# EAGLE design REV001 (EAGLE 9.7.0)
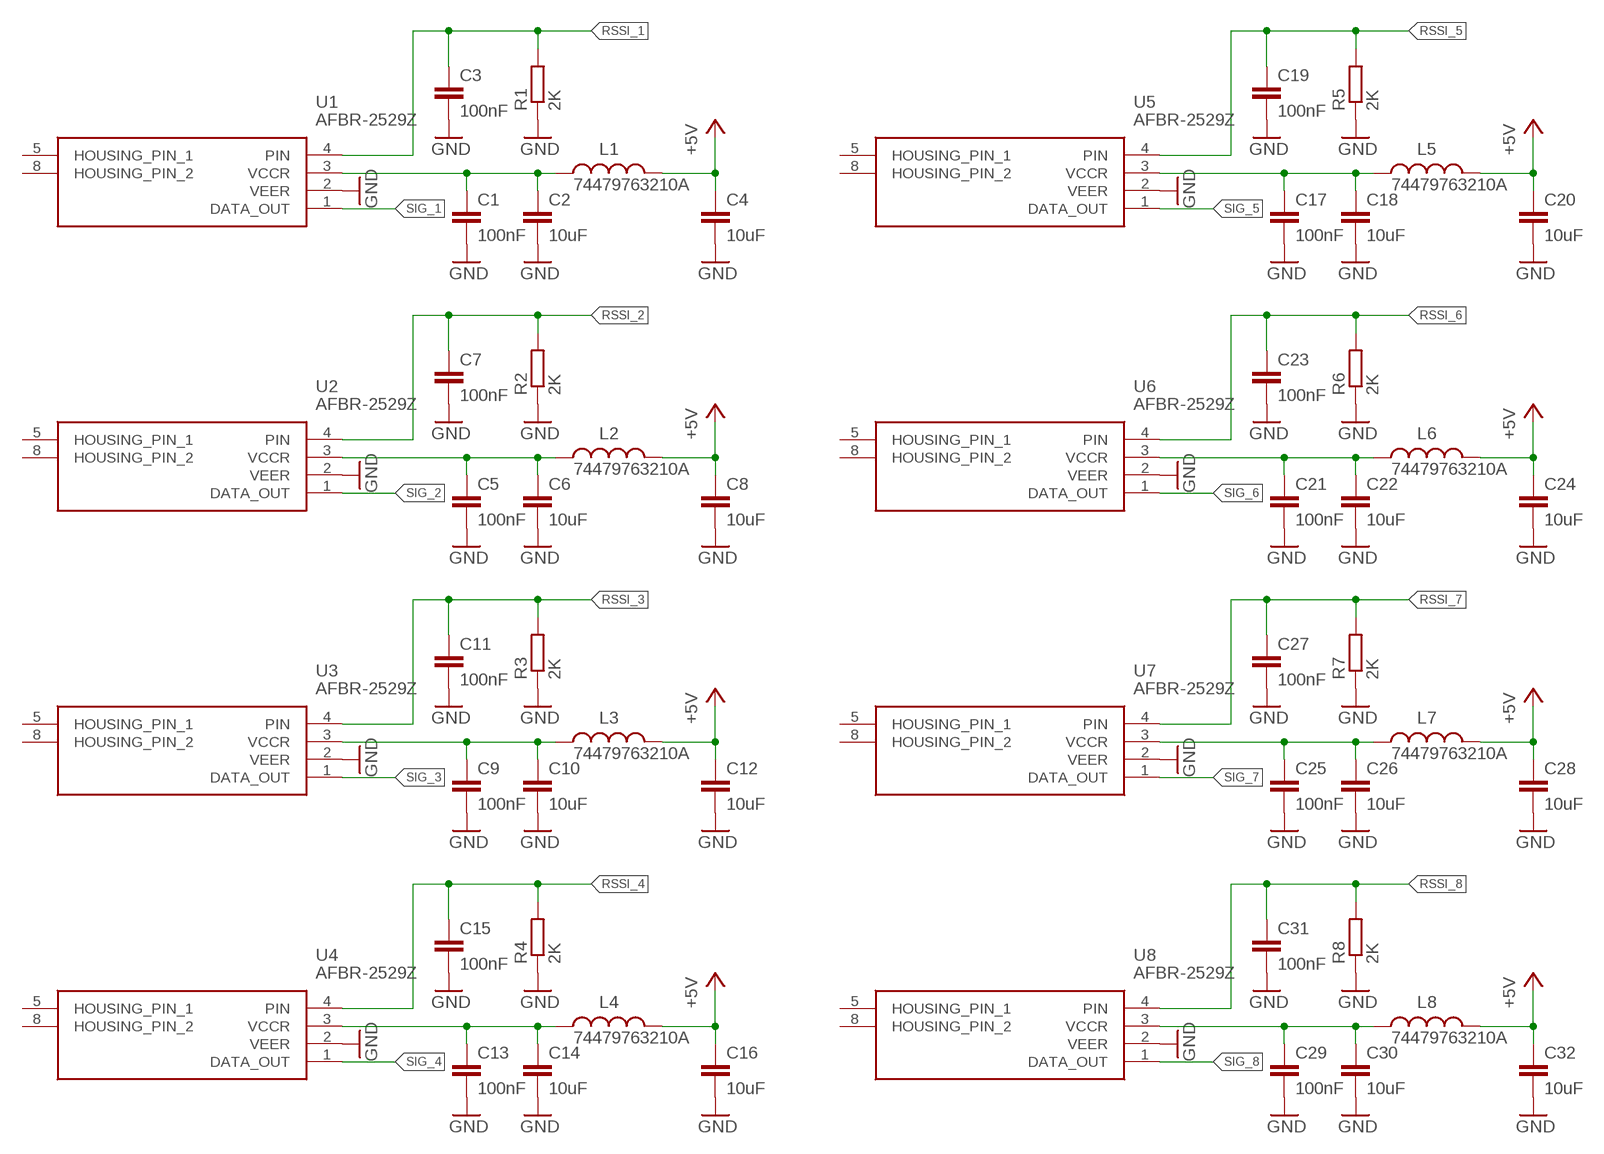
[diagram p0: schematic, sheet 1, part 1 of 2]
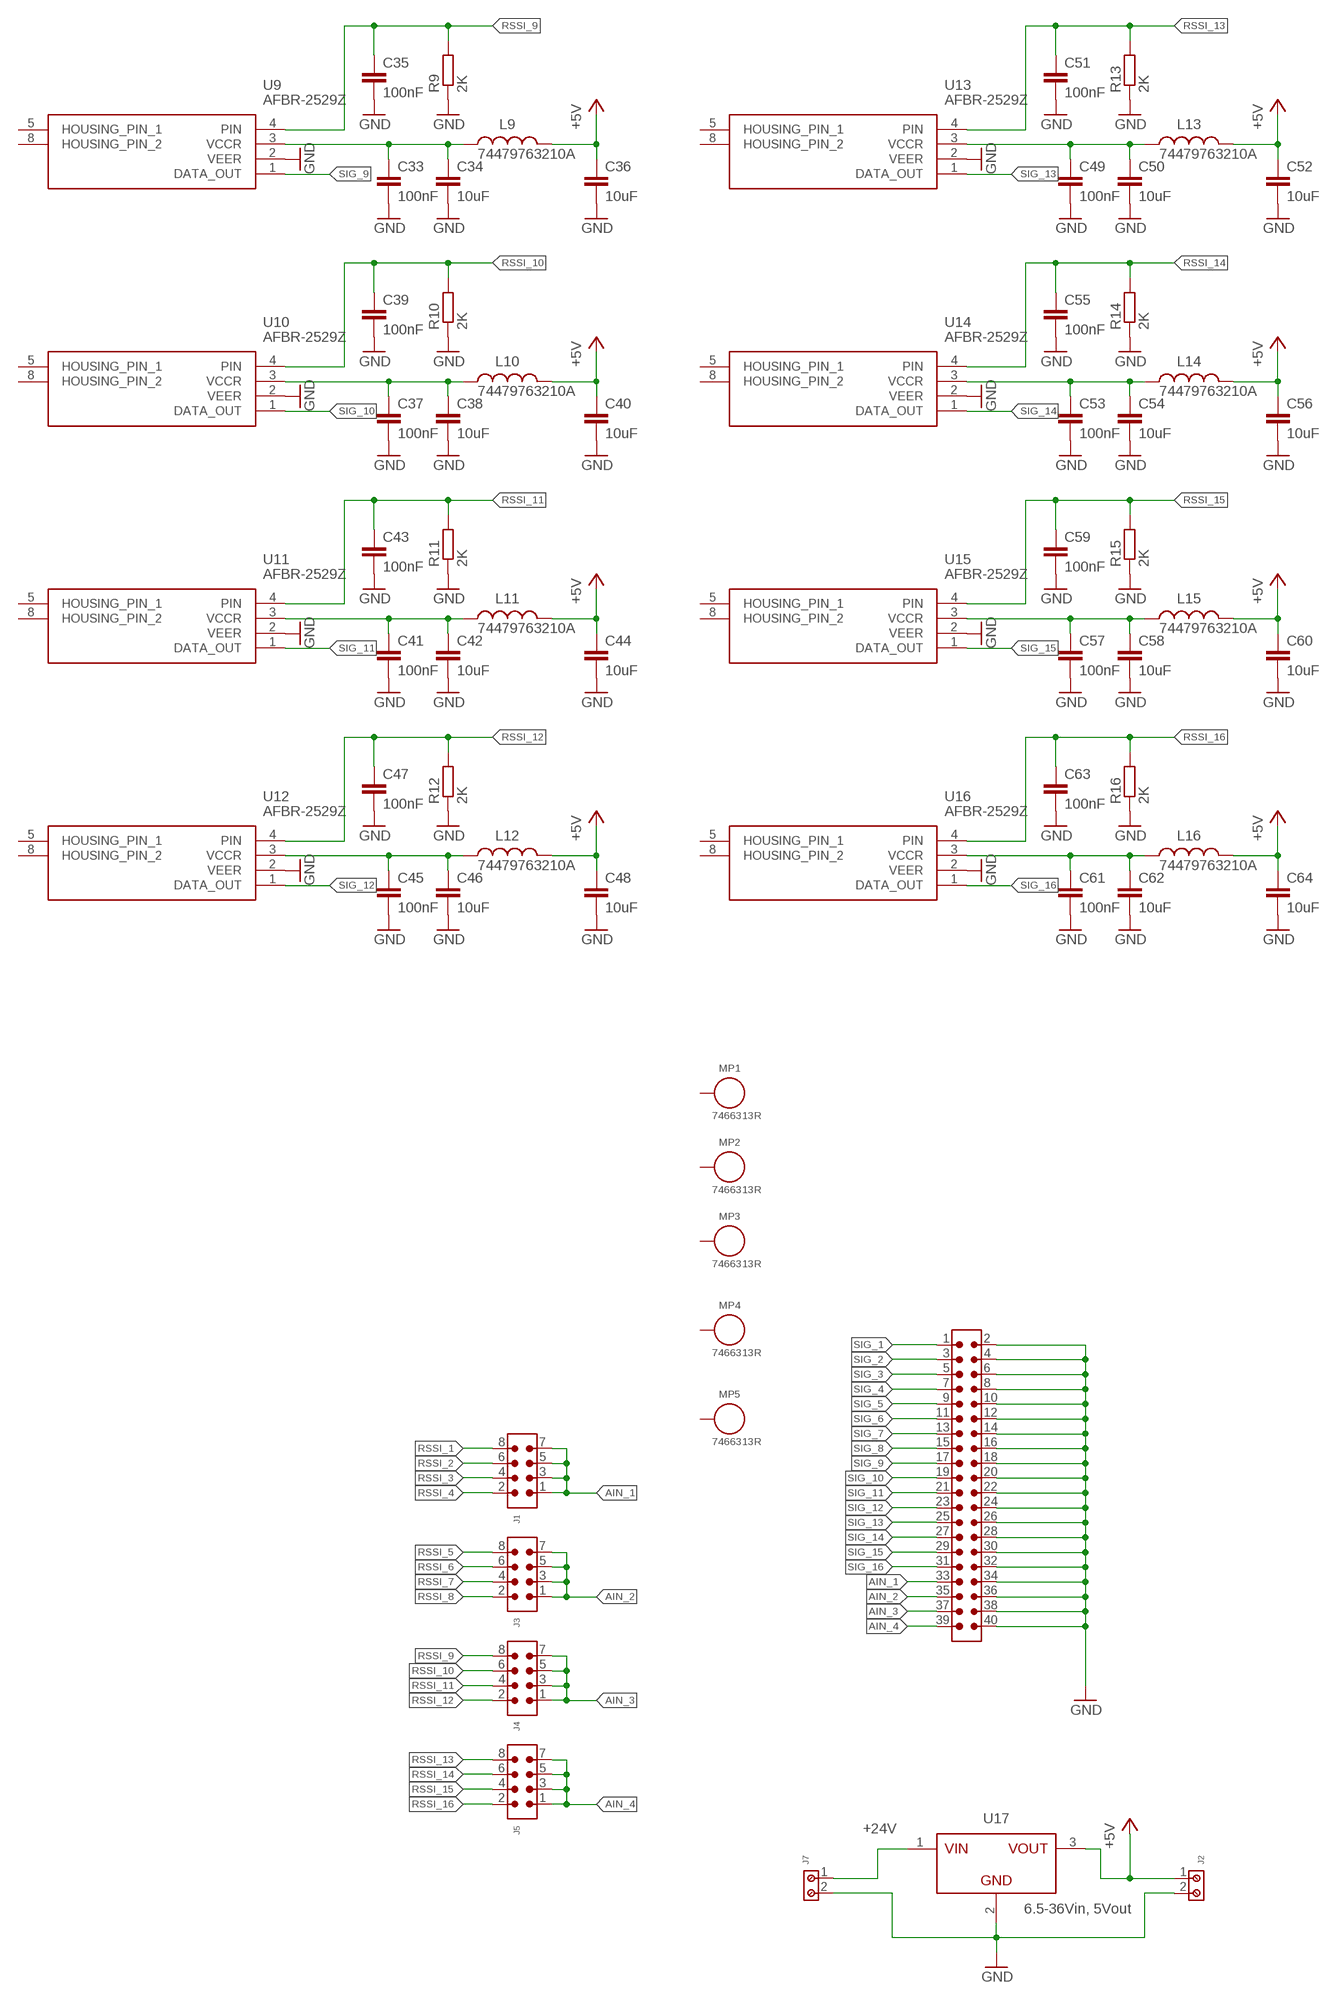
[diagram p1: schematic, sheet 1, part 2 of 2]

## Parts
C1  100nF  C-EUC0603K  [C0603K]
C2  10uF  C-EUC1210K  [C1210K]
C3  100nF  C-EUC0603K  [C0603K]
C4  10uF  C-EUC1210K  [C1210K]
C5  100nF  C-EUC0603K  [C0603K]
C6  10uF  C-EUC1210K  [C1210K]
C7  100nF  C-EUC0603K  [C0603K]
C8  10uF  C-EUC1210K  [C1210K]
C9  100nF  C-EUC0603K  [C0603K]
C10  10uF  C-EUC1210K  [C1210K]
C11  100nF  C-EUC0603K  [C0603K]
C12  10uF  C-EUC1210K  [C1210K]
C13  100nF  C-EUC0603K  [C0603K]
C14  10uF  C-EUC1210K  [C1210K]
C15  100nF  C-EUC0603K  [C0603K]
C16  10uF  C-EUC1210K  [C1210K]
C17  100nF  C-EUC0603K  [C0603K]
C18  10uF  C-EUC1210K  [C1210K]
C19  100nF  C-EUC0603K  [C0603K]
C20  10uF  C-EUC1210K  [C1210K]
C21  100nF  C-EUC0603K  [C0603K]
C22  10uF  C-EUC1210K  [C1210K]
C23  100nF  C-EUC0603K  [C0603K]
C24  10uF  C-EUC1210K  [C1210K]
C25  100nF  C-EUC0603K  [C0603K]
C26  10uF  C-EUC1210K  [C1210K]
C27  100nF  C-EUC0603K  [C0603K]
C28  10uF  C-EUC1210K  [C1210K]
C29  100nF  C-EUC0603K  [C0603K]
C30  10uF  C-EUC1210K  [C1210K]
C31  100nF  C-EUC0603K  [C0603K]
C32  10uF  C-EUC1210K  [C1210K]
C33  100nF  C-EUC0603K  [C0603K]
C34  10uF  C-EUC1210K  [C1210K]
C35  100nF  C-EUC0603K  [C0603K]
C36  10uF  C-EUC1210K  [C1210K]
C37  100nF  C-EUC0603K  [C0603K]
C38  10uF  C-EUC1210K  [C1210K]
C39  100nF  C-EUC0603K  [C0603K]
C40  10uF  C-EUC1210K  [C1210K]
C41  100nF  C-EUC0603K  [C0603K]
C42  10uF  C-EUC1210K  [C1210K]
C43  100nF  C-EUC0603K  [C0603K]
C44  10uF  C-EUC1210K  [C1210K]
C45  100nF  C-EUC0603K  [C0603K]
C46  10uF  C-EUC1210K  [C1210K]
C47  100nF  C-EUC0603K  [C0603K]
C48  10uF  C-EUC1210K  [C1210K]
C49  100nF  C-EUC0603K  [C0603K]
C50  10uF  C-EUC1210K  [C1210K]
C51  100nF  C-EUC0603K  [C0603K]
C52  10uF  C-EUC1210K  [C1210K]
C53  100nF  C-EUC0603K  [C0603K]
C54  10uF  C-EUC1210K  [C1210K]
C55  100nF  C-EUC0603K  [C0603K]
C56  10uF  C-EUC1210K  [C1210K]
C57  100nF  C-EUC0603K  [C0603K]
C58  10uF  C-EUC1210K  [C1210K]
C59  100nF  C-EUC0603K  [C0603K]
C60  10uF  C-EUC1210K  [C1210K]
C61  100nF  C-EUC0603K  [C0603K]
C62  10uF  C-EUC1210K  [C1210K]
C63  100nF  C-EUC0603K  [C0603K]
C64  10uF  C-EUC1210K  [C1210K]
J1  6130XX21121_61300821121  [61300821121]
J2  691213710002  [691213710002]
J3  6130XX21121_61300821121  [61300821121]
J4  6130XX21121_61300821121  [61300821121]
J5  6130XX21121_61300821121  [61300821121]
J6  61204021721  6120XX21721_61204021721  [61204021721]
J7  691213710002  [691213710002]
L1  74479763210A  WE-PMI_0603_74479763210A_H0.5  [WE-PMI_0603_H0.5]
L2  74479763210A  WE-PMI_0603_74479763210A_H0.5  [WE-PMI_0603_H0.5]
L3  74479763210A  WE-PMI_0603_74479763210A_H0.5  [WE-PMI_0603_H0.5]
L4  74479763210A  WE-PMI_0603_74479763210A_H0.5  [WE-PMI_0603_H0.5]
L5  74479763210A  WE-PMI_0603_74479763210A_H0.5  [WE-PMI_0603_H0.5]
L6  74479763210A  WE-PMI_0603_74479763210A_H0.5  [WE-PMI_0603_H0.5]
L7  74479763210A  WE-PMI_0603_74479763210A_H0.5  [WE-PMI_0603_H0.5]
L8  74479763210A  WE-PMI_0603_74479763210A_H0.5  [WE-PMI_0603_H0.5]
L9  74479763210A  WE-PMI_0603_74479763210A_H0.5  [WE-PMI_0603_H0.5]
L10  74479763210A  WE-PMI_0603_74479763210A_H0.5  [WE-PMI_0603_H0.5]
L11  74479763210A  WE-PMI_0603_74479763210A_H0.5  [WE-PMI_0603_H0.5]
L12  74479763210A  WE-PMI_0603_74479763210A_H0.5  [WE-PMI_0603_H0.5]
L13  74479763210A  WE-PMI_0603_74479763210A_H0.5  [WE-PMI_0603_H0.5]
L14  74479763210A  WE-PMI_0603_74479763210A_H0.5  [WE-PMI_0603_H0.5]
L15  74479763210A  WE-PMI_0603_74479763210A_H0.5  [WE-PMI_0603_H0.5]
L16  74479763210A  WE-PMI_0603_74479763210A_H0.5  [WE-PMI_0603_H0.5]
MP1  7466313R  WP-SMRA_746631X_7466313R  [WP-SMRA_7466313]
MP2  7466313R  WP-SMRA_746631X_7466313R  [WP-SMRA_7466313]
MP3  7466313R  WP-SMRA_746631X_7466313R  [WP-SMRA_7466313]
MP4  7466313R  WP-SMRA_746631X_7466313R  [WP-SMRA_7466313]
MP5  7466313R  WP-SMRA_746631X_7466313R  [WP-SMRA_7466313]
R1  2K  R-EU_R0603  [R0603]
R2  2K  R-EU_R0603  [R0603]
R3  2K  R-EU_R0603  [R0603]
R4  2K  R-EU_R0603  [R0603]
R5  2K  R-EU_R0603  [R0603]
R6  2K  R-EU_R0603  [R0603]
R7  2K  R-EU_R0603  [R0603]
R8  2K  R-EU_R0603  [R0603]
R9  2K  R-EU_R0603  [R0603]
R10  2K  R-EU_R0603  [R0603]
R11  2K  R-EU_R0603  [R0603]
R12  2K  R-EU_R0603  [R0603]
R13  2K  R-EU_R0603  [R0603]
R14  2K  R-EU_R0603  [R0603]
R15  2K  R-EU_R0603  [R0603]
R16  2K  R-EU_R0603  [R0603]
U1  AFBR-2529Z  [AFBR2624Z]
U2  AFBR-2529Z  [AFBR2624Z]
U3  AFBR-2529Z  [AFBR2624Z]
U4  AFBR-2529Z  [AFBR2624Z]
U5  AFBR-2529Z  [AFBR2624Z]
U6  AFBR-2529Z  [AFBR2624Z]
U7  AFBR-2529Z  [AFBR2624Z]
U8  AFBR-2529Z  [AFBR2624Z]
U9  AFBR-2529Z  [AFBR2624Z]
U10  AFBR-2529Z  [AFBR2624Z]
U11  AFBR-2529Z  [AFBR2624Z]
U12  AFBR-2529Z  [AFBR2624Z]
U13  AFBR-2529Z  [AFBR2624Z]
U14  AFBR-2529Z  [AFBR2624Z]
U15  AFBR-2529Z  [AFBR2624Z]
U16  AFBR-2529Z  [AFBR2624Z]
U17  6.5-36Vin, 5Vout  WPME-FDSM_SIP-3_173950536_17395XX36  [WPME-FDSM_17395XX36]

## Nets
+5V: C4.1 C8.1 C12.1 C16.1 C20.1 C24.1 C28.1 C32.1 C36.1 C40.1 C44.1 C48.1 C52.1 C56.1 C60.1 C64.1 J2.1 L1.2 L2.2 L3.2 L4.2 L5.2 L6.2 L7.2 L8.2 L9.2 L10.2 L11.2 L12.2 L13.2 L14.2 L15.2 L16.2 U17.3(VOUT)
+24V: J7.1 U17.1(VIN)
AIN_1: J1.1 J1.3 J1.5 J1.7 J6.33
AIN_2: J3.1 J3.3 J3.5 J3.7 J6.35
AIN_3: J4.1 J4.3 J4.5 J4.7 J6.37
AIN_4: J5.1 J5.3 J5.5 J5.7 J6.39
GND: C1.2 C2.2 C3.2 C4.2 C5.2 C6.2 C7.2 C8.2 C9.2 C10.2 C11.2 C12.2 C13.2 C14.2 C15.2 C16.2 C17.2 C18.2 C19.2 C20.2 C21.2 C22.2 C23.2 C24.2 C25.2 C26.2 C27.2 C28.2 C29.2 C30.2 C31.2 C32.2 C33.2 C34.2 C35.2 C36.2 C37.2 C38.2 C39.2 C40.2 C41.2 C42.2 C43.2 C44.2 C45.2 C46.2 C47.2 C48.2 C49.2 C50.2 C51.2 C52.2 C53.2 C54.2 C55.2 C56.2 C57.2 C58.2 C59.2 C60.2 C61.2 C62.2 C63.2 C64.2 J2.2 J6.2 J6.4 J6.6 J6.8 J6.10 J6.12 J6.14 J6.16 J6.18 J6.20 J6.22 J6.24 J6.26 J6.28 J6.30 J6.32 J6.34 J6.36 J6.38 J6.40 J7.2 R1.1 R2.1 R3.1 R4.1 R5.1 R6.1 R7.1 R8.1 R9.1 R10.1 R11.1 R12.1 R13.1 R14.1 R15.1 R16.1 U1.2(VEER) U2.2(VEER) U3.2(VEER) U4.2(VEER) U5.2(VEER) U6.2(VEER) U7.2(VEER) U8.2(VEER) U9.2(VEER) U10.2(VEER) U11.2(VEER) U12.2(VEER) U13.2(VEER) U14.2(VEER) U15.2(VEER) U16.2(VEER) U17.2(GND)
N$1: C1.1 C2.1 L1.1 U1.3(VCCR)
N$2: C5.1 C6.1 L2.1 U2.3(VCCR)
N$3: C9.1 C10.1 L3.1 U3.3(VCCR)
N$4: C13.1 C14.1 L4.1 U4.3(VCCR)
N$5: C17.1 C18.1 L5.1 U5.3(VCCR)
N$6: C21.1 C22.1 L6.1 U6.3(VCCR)
N$7: C25.1 C26.1 L7.1 U7.3(VCCR)
N$8: C29.1 C30.1 L8.1 U8.3(VCCR)
N$9: C33.1 C34.1 L9.1 U9.3(VCCR)
N$10: C37.1 C38.1 L10.1 U10.3(VCCR)
N$11: C41.1 C42.1 L11.1 U11.3(VCCR)
N$12: C45.1 C46.1 L12.1 U12.3(VCCR)
N$13: C49.1 C50.1 L13.1 U13.3(VCCR)
N$14: C53.1 C54.1 L14.1 U14.3(VCCR)
N$15: C57.1 C58.1 L15.1 U15.3(VCCR)
N$16: C61.1 C62.1 L16.1 U16.3(VCCR)
RSSI_1: C3.1 J1.8 R1.2 U1.4(PIN)
RSSI_2: C7.1 J1.6 R2.2 U2.4(PIN)
RSSI_3: C11.1 J1.4 R3.2 U3.4(PIN)
RSSI_4: C15.1 J1.2 R4.2 U4.4(PIN)
RSSI_5: C19.1 J3.8 R5.2 U5.4(PIN)
RSSI_6: C23.1 J3.6 R6.2 U6.4(PIN)
RSSI_7: C27.1 J3.4 R7.2 U7.4(PIN)
RSSI_8: C31.1 J3.2 R8.2 U8.4(PIN)
RSSI_9: C35.1 J4.8 R9.2 U9.4(PIN)
RSSI_10: C39.1 J4.6 R10.2 U10.4(PIN)
RSSI_11: C43.1 J4.4 R11.2 U11.4(PIN)
RSSI_12: C47.1 J4.2 R12.2 U12.4(PIN)
RSSI_13: C51.1 J5.8 R13.2 U13.4(PIN)
RSSI_14: C55.1 J5.6 R14.2 U14.4(PIN)
RSSI_15: C59.1 J5.4 R15.2 U15.4(PIN)
RSSI_16: C63.1 J5.2 R16.2 U16.4(PIN)
SIG_1: J6.1 U1.1(DATA_OUT)
SIG_2: J6.3 U2.1(DATA_OUT)
SIG_3: J6.5 U3.1(DATA_OUT)
SIG_4: J6.7 U4.1(DATA_OUT)
SIG_5: J6.9 U5.1(DATA_OUT)
SIG_6: J6.11 U6.1(DATA_OUT)
SIG_7: J6.13 U7.1(DATA_OUT)
SIG_8: J6.15 U8.1(DATA_OUT)
SIG_9: J6.17 U9.1(DATA_OUT)
SIG_10: J6.19 U10.1(DATA_OUT)
SIG_11: J6.21 U11.1(DATA_OUT)
SIG_12: J6.23 U12.1(DATA_OUT)
SIG_13: J6.25 U13.1(DATA_OUT)
SIG_14: J6.27 U14.1(DATA_OUT)
SIG_15: J6.29 U15.1(DATA_OUT)
SIG_16: J6.31 U16.1(DATA_OUT)
Unconnected: MP1.1 MP2.1 MP3.1 MP4.1 MP5.1 U1.5(HOUSING_PIN_1) U1.8(HOUSING_PIN_2) U2.5(HOUSING_PIN_1) U2.8(HOUSING_PIN_2) U3.5(HOUSING_PIN_1) U3.8(HOUSING_PIN_2) U4.5(HOUSING_PIN_1) U4.8(HOUSING_PIN_2) U5.5(HOUSING_PIN_1) U5.8(HOUSING_PIN_2) U6.5(HOUSING_PIN_1) U6.8(HOUSING_PIN_2) U7.5(HOUSING_PIN_1) U7.8(HOUSING_PIN_2) U8.5(HOUSING_PIN_1) U8.8(HOUSING_PIN_2) U9.5(HOUSING_PIN_1) U9.8(HOUSING_PIN_2) U10.5(HOUSING_PIN_1) U10.8(HOUSING_PIN_2) U11.5(HOUSING_PIN_1) U11.8(HOUSING_PIN_2) U12.5(HOUSING_PIN_1) U12.8(HOUSING_PIN_2) U13.5(HOUSING_PIN_1) U13.8(HOUSING_PIN_2) U14.5(HOUSING_PIN_1) U14.8(HOUSING_PIN_2) U15.5(HOUSING_PIN_1) U15.8(HOUSING_PIN_2) U16.5(HOUSING_PIN_1) U16.8(HOUSING_PIN_2)

## Library data of the parts
C1-C64 = rcl:C-EU: CAPACITOR, European symbol; SPICEPREFIX: C
J1 J3-J5 = Wurth_Connectors_WR-PHD:6130XX21121_61300821121: WR-PHD 2.54 mm THT Dual Pin Header ARTICLE PROPERTIES: Pins:4;​ 6;​ 8;​ 10;​ 12;​ 14;​ 16;​ 18;​ 20;​ 22;​ 24;​ 26;​ 28;​ 30;​ 32;​ 34;​ 36;​ 40;​ 44;​ 64;​ 72;​ 80 KIND PROPERTIES: Pitch：2.54 mm Quality Class:3 as per CECC 75 301-802 Rows：Dual Gender：Pin Header Type：Board Stacker MATERIAL PROPERTIES: Insulator Material :PA6T Insulator Flammability Rating:UL94 V-0 Contact Material:Copper Alloy Contact Plating:Gold Contact Type:Stamped GENERAL INFORMATION Operating Temperature:-40 up to +105 °C Compliance:Lead free / RoHS ELECTRICAL PROPERTIES: Rated Current:3 A IR 1:3 A Withstanding Voltage:500 V (AC) Contact Resistance:20 mΩ RISO:1000 MΩ CERTIFICATION UL Approval:E323964 PACKAGING PROPERTIES Packaging:Bag <https://katalog.we-online.com/media/images/v2/o33215v209%20Family_WR-PHD_6130xx21121.jpg> Details see: https://katalog.we-online.com/en/em/PHD_2_54_THT_DUAL_PIN_HEADER_6130XX21121 Updated by Yingchun,Shan 2019-10-16 2019 (C) Würth Elektronik; DATASHEET-URL: https://katalog.we-online.com/em/datasheet/61300821121.pdf; GENDER: Pin Header; IR: 3A; MATES: WR-PHD 2.54mm Angled DualSocket Header/Dual Socket Header/Dual Socket Header Bottom Entry/Dual Socket Header Bottom Entry Large/SMT Dual Socket Header/SMT Dual Socket Header Bottom Entry; PACKAGING: Bag; PART-NUMBER: 61300821121; PINS: 8; ROWS: Dual; TYPE: Board Stacker
J2 J7 = Wurth_Connectors_WR-TBL Rising Cage Clamp:691213710002: WR-TBL Serie 213 - 5.00 mm Horiz.l Entry Modular KIND PROPERTIES Pitch 5 mm MATERIAL PROPERTIES Insulator Material PA66 Insulator Flammability Rating UL94 V-0 Insulator Color Green Contact Material Brass Contact Plating Copper over Zinc Terminal Screw Material Steel Terminal Screw Plating Zinc Wire Guard Material Brass GENERAL INFORMATION Operating Temperature -40 up to +105 °C Compliance Lead free / RoHS ELECTRICAL PROPERTIES IR UL 10 A IR VDE 10 A Working Voltage [UL] 300 V (AC) Working Voltage [VDE] 250 V (AC) Withstanding Voltage [UL] 1600 V (AC) Withstanding Voltage [cULus] 1600 V (AC) Withstanding Voltage [VDE] 2000 V (AC) Contact Resistance [UL] 20 mΩ Contact Resistance [cULus] 20 mΩ Contact Resistance [VDE] 20 mΩ MECHANICAL PROPERTIES Wire Strip Length 5 up to 6 (mm) Screw M2.5 CERTIFICATION UL Approval E315414 VDE Approval 40024437 VDE Approval 40024437 PACKAGING PROPERTIES Packaging Box <https://www.we-online.com/catalog/media/o33234v209%20Family_WR-TBL_69121371000x.jpg> Details see: https://www.we-online.com/catalog/en/TBL_5_00_213_HORIZONTAL_ENTRY_MODULAR_69121371000X/ Updated by Ella Wu 2019-11-22 2019(C) Wurth Elektronik; DATASHEET-URL: https://www.we-online.com/catalog/datasheet/691213710002.pdf; IR-UL: 10A; IR-VDE: 10A; MOUNT: THT; PART-NUMBER: 691213710002; PINS: 2; PITCH: 5mm; TYPE: Horizontal; WIRE: 26 to 16 (AWG) 0.129 to 1.31 (mm²); WORKING-VOLTAGE-UL: 300V (AC); WORKING-VOLTAGE-VDE: 250V (AC)
J6 = Wurth_Connectors_WR-BHD:6120XX21721_61204021721: WR-BHD 2.54 mm Male Angled Box Header KIND PROPERTIES: Pitch 2.54 mm Gender:Male MATERIAL PROPERTIES: Insulator Material:PBT Insulator Flammability Rating UL94 V-0 Insulator Color:Black Contact Material :Copper Alloy Contact Plating :Gold Contact Type: Stamped GENERAL INFORMATION: Operating Temperature:-40 °C up to +125 °C Compliance:RoHS Working Voltage: 250 V (AC) Withstanding Voltage:500 V (AC) Contact Resistance: 20 mΩ Insulation Resistance:1000 MΩ CERTIFICATION: UL Approval:E323964 PACKAGING PROPERTIES Packaging :Tray <https://www.we-online.de/katalog/media/o32888v209%20Family_WR-BHD_6120xx21721.jpg> Details see: https://www.we-online.de/katalog/en/em/BHD_2_54_MALE_ANGLED_BOX_HEADER_6120XX21721 Updated by Yingchun,Shan 2019-10-29 2019 (C) Würth Elektronik; CONTACT-RESISTANCE: 20mOhm; DATASHEET-URL: https://www.we-online.com/catalog/datasheet/61204021721.pdf; GENDER: Male; IR: 3A; L: 58.46mm; MOUNT: THT; PACKAGING: Tray; PART-NUMBER: 61204021721; PINS: 40; PITCH: 2.54mm; TYPE: Angled; WORKING-VOLTAGE: 250V(AC)
L1-L16 = Wurth_Power Magnetics_WE-PMI:WE-PMI_0603: WE-PMI Power Multilayer Inductor Shielded Characteristics Compact multilayer type Suitable for applications with high currents up to 2.7 A Smallest RDC-Values starting at 7 mΩ Magnetically shielded construction: No crosstalk Operating temperature: –40 °C to +125 °C Recommended soldering profile: Reflow 4 sizes and 3 different types available (Low Profile, Low RDC & High Saturation Current) Applications DC/DC converters especially at high switching frequencies > 1MHz Electronic devices with very low profile Portable devices like Smart Phones, Tablets, Notebooks and Digital Cameras <https://www.we-online.com/catalog/media/o14838v209%20Family_WE-PMI.jpg> Details see: https://www.we-online.com/katalog/en/WE-PMI Updated by Ella Wu 2020-12-17 2020 (C) Wurth Elektronik; DATASHEET-URL: https://www.we-online.com/catalog/datasheet/74479762168.pdf; FRES: 150MHz; H: 0.5mm; IR1: 700mA; IR2: 1000mA; ISAT: 700mA; PART-NUMBER: 74479762168; RDC: 220mOhm; TYPE: Low Profile; VALUE: 0.68uH
MP1-MP5 = Wurth_Assembly_WP-SMRA:WP-SMRA_746631X: WP-SMRA SMT Right Angled w. Pins , M3/Ø 3.3 mm Applications 90° assembling of cable, PCB or housing Simple and fast automated assembly Low initial time and cost High mechanical forces and torques Small footprint <https://www.we-online.com/catalog/media/o80838v209%20Family_WP-SMRA_PINS.jpg> Details see: https://www.we-online.com/catalog/en/2ND_TAXONOMY_WP-SMRA_PINS/ Updated By Ella Wu 2020-07-20 2020 (C) Wurth Elektronik; DATASHEET-URL: https://www.we-online.de/katalog/datasheet/7466313R.pdf; HEIGHT: 7mm; LENGTH: 5.5mm; PART-NUMBER: 7466313R; THREAD: M3; WIDTH: 4.33mm
R1-R16 = rcl:R-EU_: RESISTOR, European symbol; SPICEPREFIX: R
U1-U16 = pke:AFBR-2529Z: Broadcom AFBR-2529Z 50MBd 685nm Fibre Optic Receiver Source: Datasheet <https://docs.broadcom.com/docs/AV02-4369EN>; DESCRIPTION: Broadcom AFBR-2529Z 50MBd 685nm Fibre Optic Receiver; HEIGHT: mm; MANUFACTURER_NAME: Avago Technologies; MANUFACTURER_PART_NUMBER: AFBR-2529Z; MOUSER_PART_NUMBER: 630-AFBR-2529Z; MOUSER_PRICE-STOCK: https://www.mouser.co.uk/ProductDetail/Broadcom-Avago/AFBR-2529Z?qs=60YbxKv0rtC4i47%2FWZNJsQ%3D%3D
U17 = Wurth_Step Down Converter_MagI³C-FDSM:WPME-FDSM_SIP-3: MagI³C-FDSM Fixed Step Down Regulator Module Characteristics Simplest design (no power supply knowledge required) Leaded through-hole package for easy manufacturing and prototyping Stand alone solution (CIN and COUT integrated, no external components) L78x series linear regulator replacement (no heatsink required) Low conducted and radiated EMI (compliant to EN55022 class B) Applications Point-of-Load from 24V, 18V, 15V, 12V, 9V rail Replacement for linear regulators Interface and microcontroller supply Industrial, Test & Measurement, Medical applications System power supplies <https://www.we-online.com/catalog/media/o55808v209%20Family_FDSM_NEU.jpg> Details see: www.we-online.com/catalog/MAGIC_FDSM_FIXED_OUTPUT_VOLTAGE <www.we-online.com/catalog/MAGIC_FDSM_FIXED_OUTPUT_VOLTAGE/?utm_source=eagle_model&utm_medium=description_link&utm_campaign=eisos_eagle> Updated by Ella Wu 2022-07-21 2022 (C) Würth Elektronik; DATASHEET-URL: https://www.we-online.com/redexpert/spec/173950536?ae; HEIGHT: 10.16mm; I-OUTPUT: 0.5A; LENGTH: 11.6mm; MOUNT: THT; PART-NUMBER: 173950536; V-INPUT: 6.5-36V; V-OUTPUT: 5V; WIDTH: 7.55mm

## Board
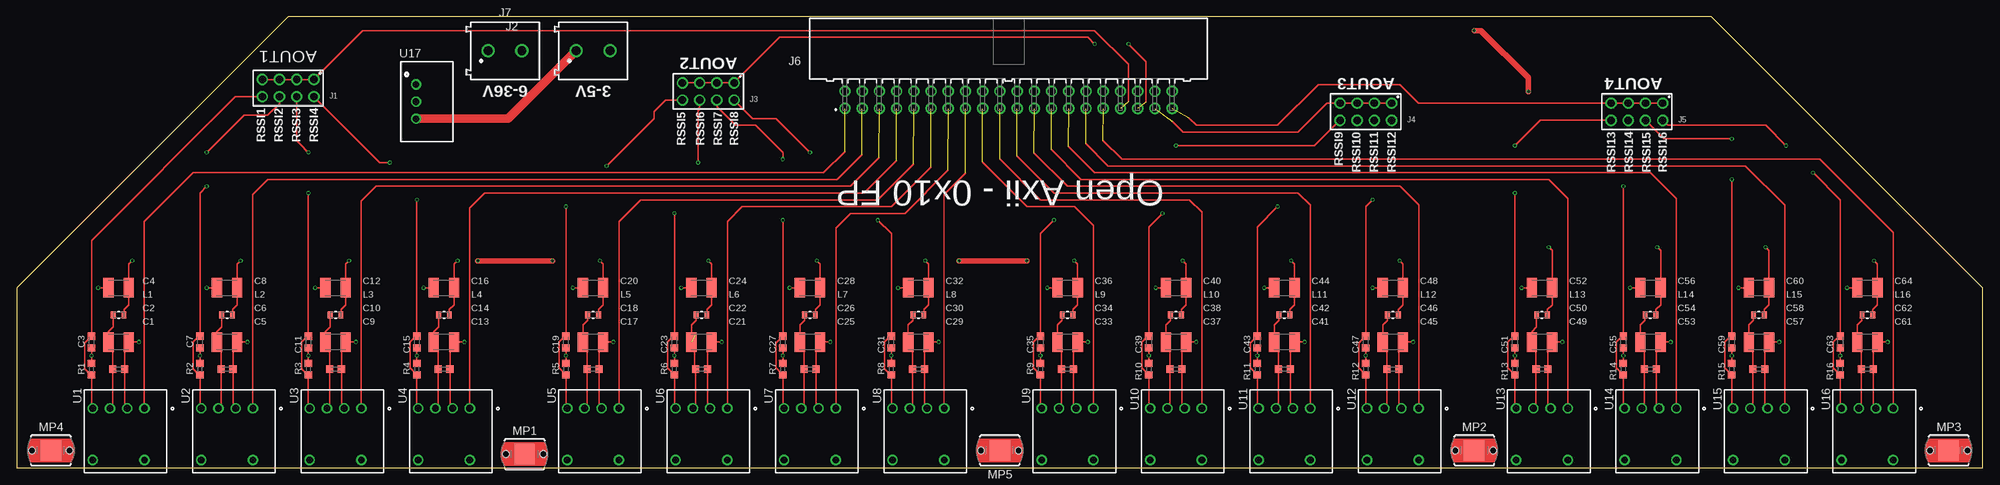
[diagram p2: board, top side]
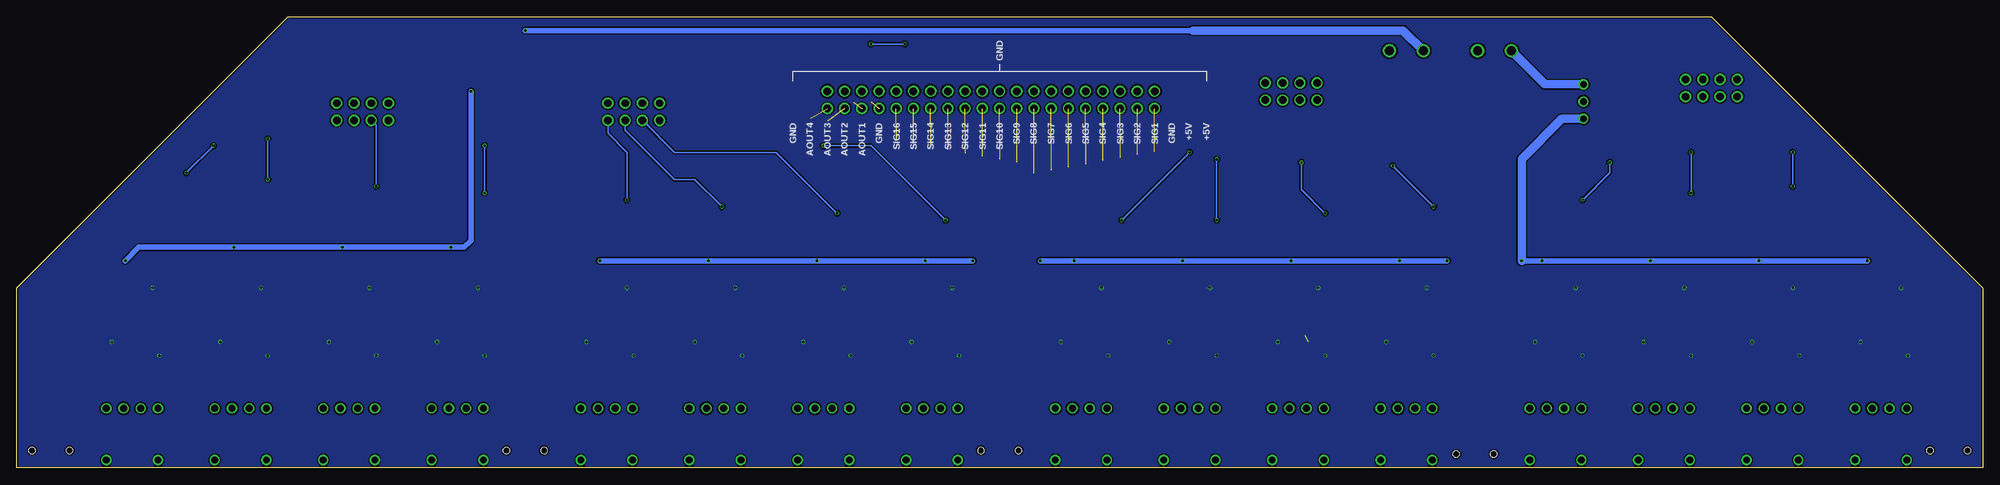
[diagram p3: board, bottom side, seen from below]

Size 290 x 66.6 mm. Coordinates in mm from the lower left corner, seen from the top.
Outline: 0,26.6 0,0 290,0 290,26.6 250,66.6 40,66.6 0,26.6
Copper layers (1*2*15*16): Top / Route2 / Route15 / Bottom
Stack-up Default Layer Stack: Top User Defined 0.035mm / Dielectric-2 User Defined 0.2mm / Route2 User Defined 0.0175mm / Dielectric-1 User Defined 0.3mm / Route15 User Defined 0.0175mm / Dielectric-3 User Defined 0.2mm / Bottom User Defined 0.035mm
Design rules "jlc": minimum track width 6mil, minimum drill 12mil, track to track 6mil, track to pad 8mil, pad to pad 8mil, via to via 8mil, smd to smd 0mil, copper to edge 10mil, drill to drill 8mil, minimum pad ring 6mil, minimum via ring 4mil, stop-mask expansion 4mil, vias tented up to drill 25mil, thermal gap 10mil

### Footprints (pad centres in the part's own frame; a part is rotated, then mirrored left to right if it is on the bottom)
C0603K = smd 1.05 x 1.08: 1 -0.875,0; 2 0.875,0
C1210K = smd 1.5 x 2.9: 1 -1.5,0; 2 1.5,0
61300821121 = drill 1.1: 1 -3.81,-1.27; 2 -3.81,1.27; 3 -1.27,-1.27; 4 -1.27,1.27; 5 1.27,-1.27; 6 1.27,1.27; 7 3.81,-1.27; 8 3.81,1.27
691213710002 = drill 1.3: 1 -2.5,0; 2 2.5,0
61204021721 = drill 1.1: 1 24.13,8.805; 2 24.13,6.265; 3 21.59,8.805; 4 21.59,6.265; 5 19.05,8.805; 6 19.05,6.265; 7 16.51,8.805; 8 16.51,6.265; 9 13.97,8.805; 10 13.97,6.265; 11 11.43,8.805; 12 11.43,6.265; 13 8.89,8.805; 14 8.89,6.265; 15 6.35,8.805; 16 6.35,6.265; 17 3.81,8.805; 18 3.81,6.265; 19 1.27,8.805; 20 1.27,6.265; 21 -1.27,8.805; 22 -1.27,6.265; 23 -3.81,8.805; 24 -3.81,6.265; 25 -6.35,8.805; 26 -6.35,6.265; 27 -8.89,8.805; 28 -8.89,6.265; 29 -11.43,8.805; 30 -11.43,6.265; 31 -13.97,8.805; 32 -13.97,6.265; 33 -16.51,8.805; 34 -16.51,6.265; 35 -19.05,8.805; 36 -19.05,6.265; 37 -21.59,8.805; 38 -21.59,6.265; 39 -24.13,8.805; 40 -24.13,6.265
WE-PMI_0603_H0.5 = smd 0.7 x 1: 1 -0.8,0; 2 0.8,0
WP-SMRA_7466313 = smd 3 x 3: 1 0,0 | hole 0.97: -2.77,0; 2.77,0
R0603 = smd 1 x 1.1: 1 -0.85,0; 2 0.85,0
AFBR2624Z = drill 1.01 pad 1.51: 1 3.81,0; 2 1.27,0; 3 -1.27,0; 4 -3.81,0; 5 -3.81,-7.62; 8 3.81,-7.62
WPME-FDSM_17395XX36 = drill 1: 1 -2.54,-1.625; 2 0,-1.625; 3 2.54,-1.625

### Placement (x,y rotation side)
C1  15,14.6 0 top
C2  15,18.6 0 top
C3  11,18.6 270 top
C4  15,26.6 180 top
C5  31,14.6 0 top
C6  31,18.6 0 top
C7  27,18.6 270 top
C8  31,26.6 180 top
C9  47,14.6 0 top
C10  47,18.6 0 top
C11  43,18.6 270 top
C12  47,26.6 180 top
C13  63,14.6 0 top
C14  63,18.6 0 top
C15  59,18.6 270 top
C16  63,26.6 180 top
C17  85,14.6 0 top
C18  85,18.6 0 top
C19  81,18.6 270 top
C20  85,26.6 180 top
C21  101,14.6 0 top
C22  101,18.6 0 top
C23  97,18.6 270 top
C24  101,26.6 180 top
C25  117,14.6 0 top
C26  117,18.6 0 top
C27  113,18.6 270 top
C28  117,26.6 180 top
C29  133,14.6 0 top
C30  133,18.6 0 top
C31  129,18.6 270 top
C32  133,26.6 180 top
C33  155,14.6 0 top
C34  155,18.6 0 top
C35  151,18.6 270 top
C36  155,26.6 180 top
C37  171,14.6 0 top
C38  171,18.6 0 top
C39  167,18.6 270 top
C40  171,26.6 180 top
C41  187,14.6 0 top
C42  187,18.6 0 top
C43  183,18.6 270 top
C44  187,26.6 180 top
C45  203,14.6 0 top
C46  203,18.6 0 top
C47  199,18.6 270 top
C48  203,26.6 180 top
C49  225,14.6 0 top
C50  225,18.6 0 top
C51  221,18.6 270 top
C52  225,26.6 180 top
C53  241,14.6 0 top
C54  241,18.6 0 top
C55  237,18.6 270 top
C56  241,26.6 180 top
C57  257,14.6 0 top
C58  257,18.6 0 top
C59  253,18.6 270 top
C60  257,26.6 180 top
C61  273,14.6 0 top
C62  273,18.6 0 top
C63  269,18.6 270 top
C64  273,26.6 180 top
J1  40,56.1 180 top
J2  85,61.6 0 top
J3  102,55.6 180 top
J4  199,52.6 180 top
J5  239,52.6 180 top
J6  146.3,61.9 180 top
J7  72,61.6 0 top
L1  15,22.6 0 top
L2  31,22.6 0 top
L3  47,22.6 0 top
L4  63,22.6 0 top
L5  85,22.6 0 top
L6  101,22.6 0 top
L7  117,22.6 0 top
L8  133,22.6 0 top
L9  155,22.6 0 top
L10  171,22.6 0 top
L11  187,22.6 0 top
L12  203,22.6 0 top
L13  225,22.6 0 top
L14  241,22.6 0 top
L15  257,22.6 0 top
L16  273,22.6 0 top
MP1  74.89,2.04 180 top
MP2  215,2.6 180 top
MP3  285,2.6 180 top
MP4  5,2.6 180 top
MP5  145,2.6 180 top
R1  11,14.6 270 top
R2  27,14.6 270 top
R3  43,14.6 270 top
R4  59,14.6 270 top
R5  81,14.6 270 top
R6  97,14.6 270 top
R7  113,14.6 270 top
R8  129,14.6 270 top
R9  151,14.6 270 top
R10  167,14.6 270 top
R11  183,14.6 270 top
R12  199,14.6 270 top
R13  221,14.6 270 top
R14  237,14.6 270 top
R15  253,14.6 270 top
R16  269,14.6 270 top
U1  15,8.8 0 top
U2  31,8.8 0 top
U3  47,8.8 0 top
U4  63,8.8 0 top
U5  85,8.8 0 top
U6  101,8.8 0 top
U7  117,8.8 0 top
U8  133,8.8 0 top
U9  155,8.8 0 top
U10  171,8.8 0 top
U11  187,8.8 0 top
U12  203,8.8 0 top
U13  225,8.8 0 top
U14  241,8.8 0 top
U15  257,8.8 0 top
U16  273,8.8 0 top
U17  60.5,54.1 270 top

### Tracks (layer width: path | path; a pad name or v marks a point on that pad's centre or on a via)
+5V  (via drill 0.35)
  Top 0.254: L1.2 15.8,23.4 16.5,24.1 C4.1 16.5,30.1 v17,30.6 | L2.2 31.8,23.4 32.5,24.1 C8.1 32.5,30.1 v33,30.6 | L3.2 47.8,23.4 48.5,24.1 C12.1 48.5,30.1 v49,30.6 | L4.2 63.8,23.4 64.5,24.1 C16.1 64.5,30.1 v65,30.6 | L5.2 85.8,23.4 86.5,24.1 C20.1 86.5,30.1 v86,30.6 | L6.2 101.8,23.4 102.5,24.1 C24.1 102.5,30.1 v102,30.6 | L7.2 117.8,23.4 118.5,24.1 C28.1 118.5,30.1 v118,30.6 | L8.2 133.8,23.4 134.5,24.1 C32.1 134.5,30.1 v134,30.6 | L9.2 155.8,23.4 156.5,24.1 C36.1 156.5,30.1 v156,30.6 | L10.2 171.8,23.4 172.5,24.1 C40.1 172.5,30.1 v172,30.6 | L11.2 187.8,23.4 188.5,24.1 C44.1 188.5,30.1 v188,30.6 | L12.2 203.8,23.4 204.5,24.1 C48.1 204.5,30.1 v204,30.6 | L13.2 225.8,23.4 226.5,24.1 C52.1 226.5,32.1 v226,32.6 | L14.2 241.8,23.4 242.5,24.1 C56.1 242.5,32.1 v242,32.6 | L15.2 257.8,23.4 258.5,24.1 C60.1 258.5,32.1 v258,32.6 | L16.2 273.8,23.4 274.5,24.1 C64.1 274.5,30.1 v274,30.6
  Top 0.813: v223,55.6 223,57.6 216,64.6 v215,64.6 | v149,30.6 v139,30.6 | v79,30.6 v68,30.6
  Top 1.27: U17.3 72.46,51.56 J2.1
  Bottom 0.813: v274,30.6 272,32.6 v258,32.6 v242,32.6 v226,32.6 224,32.6 223,33.6 v223,55.6 | v215,64.6 116.5,64.6 | v204,30.6 v188,30.6 v172,30.6 v156,30.6 v149,30.6 | v139,30.6 v134,30.6 v118,30.6 v102,30.6 v86,30.6 v79,30.6 | v68,30.6 v65,30.6 v49,30.6 v33,30.6 v17,30.6
  Bottom 1.27: v68,30.6 68,45.6 62.04,51.56 U17.3 | 116.5,64.6 85.5,64.6 J2.1
+24V
  Bottom 1.27: U17.1 64.54,56.64 J7.1
AIN_1  (1 unrouted)
  Top 0.254: J1.7 J1.5 J1.3 J1.1 51.04,64.6 159,64.6 164,59.6 164,54.12
AIN_2  (via drill 0.35)  (1 unrouted)
  Top 0.254: J3.7 J3.5 J3.3 J3.1 112.54,63.6 158,63.6 v159,62.6 | v164,62.6 166.6,60 166.6,54.05
  Bottom 0.254: v159,62.6 v164,62.6
AIN_3  (1 unrouted)
  Top 0.254: J4.1 J4.3 J4.5 J4.7 193.27,53.87 189,49.6 172,49.6 170.4,51.2
AIN_4  (1 unrouted)
  Top 0.254: 172.94,51.66 174,50.6 186,50.6 192,56.6 204,56.6 206.73,53.87 J5.7 J5.5 J5.3 J5.1
GND  (via drill 0.35)
  Top 0.254: U1.2 15.88,9.2 C1.2 15.88,17.98 C2.2 v18,18.6 | U2.2 31.88,9.2 C5.2 31.88,17.98 C6.2 v34,18.6 | U3.2 47.88,9.2 C9.2 47.88,17.98 C10.2 v50,18.6 | U4.2 63.88,9.2 C13.2 63.88,17.98 C14.2 v66,18.6 | R1.1 v11,16.6 C3.2 | C4.2 v12,26.6 | R2.1 v27,16.6 C7.2 | C8.2 v28,26.6 | R3.1 v43,16.6 C11.2 | C12.2 v44,26.6 | R4.1 v59,16.6 C15.2 | C16.2 v60,26.6 | R5.1 v81,16.6 C19.2 | U5.2 85.88,9.2 C17.2 85.88,17.98 C18.2 v88,18.6 | C20.2 v82,26.6 | R6.1 v97,16.6 C23.2 | U6.2 101.88,9.2 C21.2 101.88,17.98 C22.2 v104,18.6 | C24.2 v98,26.6 | R7.1 v113,16.6 C27.2 | C28.2 v114,26.6 | v120,18.6 C26.2 117.88,17.98 C25.2 117.88,9.2 U7.2 | U8.2 133.88,9.2 C29.2 133.88,17.98 C30.2 v136,18.6 | C32.2 v130,26.6 | R8.1 v129,16.6 C31.2 | v158,18.6 C34.2 155.88,17.98 C33.2 155.88,9.2 U9.2 | C36.2 v152,26.6 | R9.1 v151,16.6 C35.2 | C40.2 v168,26.6 | v174,18.6 C38.2 171.88,17.98 C37.2 171.88,9.2 U10.2 | R10.1 v167,16.6 C39.2 | C44.2 v184,26.6 | C42.2 189,18.6 | 189,18.6 v190,18.6 | C43.2 v183,16.6 R11.1 | U11.2 187.88,9.2 C41.2 187.88,17.48 189,18.6 | U12.2 203.88,9.2 C45.2 203.88,17.98 C46.2 v206,18.6 | C48.2 v200,26.6 | C47.2 v199,16.6 R12.1 | U13.2 225.88,9.2 C49.2 225.88,17.98 C50.2 v228,18.6 | C52.2 v222,26.6 | R13.1 v221,16.6 C51.2 | R14.1 v237,16.6 C55.2 | C56.2 v238,26.6 | v244,18.6 C54.2 241.88,17.98 C53.2 241.88,9.2 U14.2 | R15.1 v253,16.6 C59.2 | U15.2 257.88,9.2 C57.2 257.88,17.98 C58.2 v260,18.6 | C60.2 v254,26.6 | U16.2 273.88,9.2 C61.2 273.88,17.98 C62.2 v276,18.6 | R16.1 v269,16.6 C63.2 | C64.2 v270,26.6
  pour Bottom: 0,-0.4 290,-0.4 290,26.6 250,66.6 40,66.6 0,26.6
N$1
  Top 0.254: U1.3 14.12,9.2 C1.1 14.12,17.98 C2.1 13.5,20.1 14.2,20.8 L1.1
N$2
  Top 0.254: U2.3 30.12,9.2 C5.1 30.12,17.98 C6.1 29.5,20.1 30.2,20.8 L2.1
N$3
  Top 0.254: U3.3 46.12,9.2 C9.1 46.12,17.98 C10.1 45.5,20.1 46.2,20.8 L3.1
N$4
  Top 0.254: U4.3 62.12,9.2 C13.1 62.12,17.98 C14.1 61.5,20.1 62.2,20.8 L4.1
N$5
  Top 0.254: U5.3 84.12,9.2 C17.1 84.12,17.98 C18.1 83.5,21.1 84.2,21.8 L5.1
N$6  (1 unrouted)
  Top 0.254: U6.3 100.12,9.2 C21.1 100,14.72 100,19.6 | C22.1 99.5,21.1 100.2,21.8 L6.1
N$7
  Top 0.254: U7.3 116.12,9.2 C25.1 116.12,17.98 C26.1 115.5,21.1 116.2,21.8 L7.1
N$8
  Top 0.254: U8.3 132.12,9.2 C29.1 132.12,17.98 C30.1 131.5,21.1 132.2,21.8 L8.1
N$9
  Top 0.254: L9.1 154.2,21.8 153.5,21.1 C34.1 154.12,17.98 C33.1 154.12,9.2 U9.3
N$10
  Top 0.254: U10.3 170.12,9.2 C37.1 170.12,17.98 C38.1 169.5,21.1 170.2,21.8 L10.1
N$11
  Top 0.254: U11.3 186.12,9.2 C41.1 186.12,17.98 C42.1 185.5,21.1 186.2,21.8 L11.1
N$12
  Top 0.254: U12.3 202.12,9.2 C45.1 202.12,17.98 C46.1 201.5,21.1 202.2,21.8 L12.1
N$13
  Top 0.254: U13.3 224.12,9.2 C49.1 224.12,17.98 C50.1 223.5,20.1 224.2,20.8 L13.1
N$14
  Top 0.254: U14.3 240.12,9.2 C53.1 240.12,17.98 C54.1 239.5,21.1 240.2,21.8 L14.1
N$15
  Top 0.254: U15.3 256.12,9.2 C57.1 256.12,17.98 C58.1 255.5,21.1 256.2,21.8 L15.1
N$16
  Top 0.254: U16.3 272.12,9.2 C61.1 272.12,17.98 C62.1 271.5,21.1 272.2,21.8 L16.1
RSSI_1
  Top 0.254: U1.4 11,8.99 R1.2 10.85,13.75 10,14.6 10,18.48 C3.1 11,33.6 32.23,54.83 J1.8
RSSI_2  (via drill 0.35)
  Top 0.254: U2.4 27,8.99 R2.2 26.85,13.75 26,14.6 26,18.6 26.88,19.48 C7.1 27,40.6 v28,41.6 | v28,46.6 33.5,52.1 37,52.1 38.73,53.83 J1.6
  Bottom 0.254: v28,41.6 v28,46.6
RSSI_3  (via drill 0.35)
  Top 0.254: U3.4 43,8.99 R3.2 42.85,13.75 42,14.6 42,18.6 42.88,19.48 C11.1 v43,40.6 | v43,46.6 41.75,47.85 41.27,48.33 41.27,48.6 J1.4
  Bottom 0.254: v43,40.6 v43,46.6
RSSI_4  (via drill 0.35)
  Top 0.254: U4.4 59,8.99 R4.2 58,14.75 58,18.6 58.88,19.48 C15.1 v59,39.6 | v55,45.1 53.54,45.1 J1.2
  Bottom 0.254: v59,39.6 55,43.6 v55,45.1
RSSI_5  (via drill 0.35)
  Top 0.254: C19.1 81,19.6 | 81,19.6 v81,38.6 | v87,44.6 94,51.6 94,52.6 95.73,54.33 J3.8 | U5.4 81,8.99 R5.2 80,14.75 80,18.6 81,19.6
  Bottom 0.254: v81,38.6 v87,44.6
RSSI_6  (via drill 0.35)
  Top 0.254: C23.1 97,19.6 | 97,19.6 v97,37.6 | v100.5,45.1 100.5,53.1 100.73,52.87 J3.6 | U6.4 97,8.99 R6.2 96,14.75 96,18.6 97,19.6
  Bottom 0.254: v100.5,45.1 100.5,41.1 v97,37.6
RSSI_7  (via drill 0.35)
  Top 0.254: v113,36.6 C27.1 112,18.48 112,14.75 R7.2 113,8.99 U7.4 | v113,45.6 113,46.6 109,50.6 106,50.6 103.27,53.33 J3.4
  Bottom 0.254: v113,36.6 v113,45.6
RSSI_8  (via drill 0.35)
  Top 0.254: C31.1 129,19.6 | 129,19.6 129,34.6 v127,36.6 | v117,46.6 112,51.6 108.54,51.6 J3.2 | U8.4 129,8.99 R8.2 128.85,13.75 128,14.6 128,18.6 129,19.6
  Bottom 0.254: v127,36.6 v117,46.6
RSSI_9  (via drill 0.35)
  Top 0.254: 151,19.6 151,34.6 v153,36.6 | 151,19.6 C35.1 | v171,47.6 191.46,47.6 J4.8 | U9.4 151,8.99 R9.2 150,14.75 150,18.6 151,19.6
  Bottom 0.254: v153,36.6 164,47.6 v171,47.6
RSSI_10  (via drill 0.35)
  Top 0.254: 167,19.6 167,35.6 v169,37.6 | 167,19.6 C39.1 | U10.4 167,8.99 R10.2 166,14.75 166,18.6 167,19.6
  Bottom 0.254: v169,37.6 178,46.6 193,46.6 J4.6
RSSI_11  (via drill 0.35)
  Top 0.254: v186,38.6 183,35.6 C43.1 182,18.48 182,14.75 R11.2 183,8.99 U11.4
  Bottom 0.254: v186,38.6 190,42.6 193,42.6 200.27,49.87 J4.4
RSSI_12  (via drill 0.35)
  Top 0.254: v200,39.6 199,38.6 C47.1 198,18.48 198,14.75 R12.2 199,8.99 U12.4
  Bottom 0.254: v200,39.6 200,46.6 202.81,49.41 J4.2
RSSI_13  (via drill 0.35)
  Top 0.254: C51.1 221,19.6 | 221,19.6 v221,40.6 | v221,47.6 224.73,51.33 J5.8 | U13.4 221,8.99 R13.2 220,14.75 220,18.6 221,19.6
  Bottom 0.254: v221,47.6 v221,40.6
RSSI_14  (via drill 0.35)
  Top 0.254: C55.1 237,19.6 | 237,19.6 v237,41.6 | U14.4 237,8.99 R14.2 236,14.75 236,18.6 237,19.6
  Bottom 0.254: v237,41.6 237,50.6 J5.6
RSSI_15  (via drill 0.35)
  Top 0.254: C59.1 253,19.6 | 253,19.6 v253,42.6 | v253,48.6 243,48.6 J5.4 | U15.4 253,8.99 R15.2 252,14.75 252,18.6 253,19.6
  Bottom 0.254: v253,42.6 v253,48.6
RSSI_16  (via drill 0.35)
  Top 0.254: C63.1 269,19.6 | 269,19.6 269,39.6 v265,43.6 | v261,47.6 258,50.6 243.54,50.6 J5.2 | U16.4 269,8.99 R16.2 268,14.75 268,18.6 269,19.6
  Bottom 0.254: v265,43.6 v261,47.6
SIG_1  (1 unrouted)
  Top 0.254: U1.1 18.81,36.41 26,43.6 119,43.6 122.14,46.74
SIG_2  (1 unrouted)
  Top 0.254: U2.1 34.81,40.41 37,42.6 121,42.6 124.68,46.28
SIG_3  (1 unrouted)
  Top 0.254: U3.1 50.81,39.41 53,41.6 123,41.6 127.22,45.82
SIG_4  (1 unrouted)
  Top 0.254: U4.1 66.81,38.41 68.75,40.35 69,40.6 125,40.6 129.76,45.36
SIG_5  (1 unrouted)
  Top 0.254: U5.1 88.81,36.41 92,39.6 127,39.6 132.3,44.9
SIG_6  (1 unrouted)
  Top 0.254: U6.1 104.81,36.41 107,38.6 129,38.6 134.84,44.44
SIG_7  (1 unrouted)
  Top 0.254: U7.1 120.81,35.41 123,37.6 131,37.6 137.38,43.98
SIG_8  (1 unrouted)
  Top 0.254: U8.1 136.81,40.41 139.92,43.52
SIG_9  (1 unrouted)
  Top 0.254: U9.1 158.81,35.79 156,38.6 149,38.6 142.46,45.14
SIG_10  (1 unrouted)
  Top 0.254: U10.1 174.81,37.79 173,39.6 151,39.6 145,45.6
SIG_11  (1 unrouted)
  Top 0.254: U11.1 190.81,38.79 189,40.6 153,40.6 147.54,46.06
SIG_12  (1 unrouted)
  Top 0.254: U12.1 206.81,38.79 204,41.6 155,41.6 150.08,46.52
SIG_13  (1 unrouted)
  Top 0.254: U13.1 228.81,39.79 226,42.6 157,42.6 152.62,46.98
SIG_14  (1 unrouted)
  Top 0.254: U14.1 244.81,39.79 241,43.6 159,43.6 155.16,47.44
SIG_15  (1 unrouted)
  Top 0.254: U15.1 260.81,38.79 255,44.6 161,44.6 157.7,47.9
SIG_16  (1 unrouted)
  Top 0.254: U16.1 276.81,34.79 266,45.6 163,45.6 160.24,48.36

### Text on the board
tPlace: AOUT1 | AOUT2 | AOUT3 | AOUT4 | 6-36V | 3-5V | RSSI1 | RSSI2 | RSSI3 | RSSI4 | RSSI5 | RSSI6 | RSSI7 | RSSI8 | RSSI9 | RSSI10 | RSSI11 | RSSI12 | RSSI13 | RSSI14 | RSSI15 | RSSI16 | Open Axii - 0x10 FP
bPlace: GND | +5V | +5V | GND | SIG1 | SIG2 | SIG3 | SIG4 | SIG5 | SIG6 | SIG7 | SIG8 | SIG9 | SIG10 | SIG11 | SIG12 | SIG13 | SIG14 | SIG15 | SIG16 | GND | AOUT1 | AOUT2 | AOUT3 | AOUT4 | GND